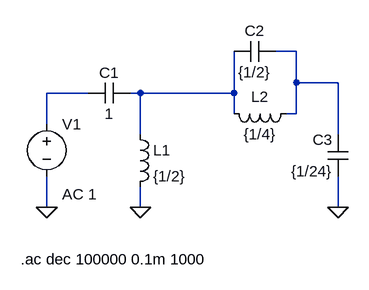
[diagram p0: schematic 2_bonus.asc]
2_bonus.asc, the LTspice schematic file:
Version 4.1
SHEET 1 880 680
WIRE 400 64 368 64
WIRE 400 112 400 64
WIRE 464 112 400 112
WIRE 80 128 16 128
WIRE 160 128 144 128
WIRE 304 128 304 64
WIRE 304 128 160 128
WIRE 304 160 304 128
WIRE 400 160 400 112
WIRE 400 160 384 160
WIRE 16 176 16 128
WIRE 160 192 160 128
WIRE 464 192 464 112
WIRE 16 304 16 256
WIRE 160 304 160 272
WIRE 464 304 464 256
FLAG 464 304 0
FLAG 160 304 0
FLAG 16 304 0
SYMBOL cap 80 144 R270
WINDOW 0 32 32 VTop 2
WINDOW 3 0 32 VBottom 2
SYMATTR InstName C1
SYMATTR Value 1
SYMBOL cap 368 48 R90
WINDOW 0 0 32 VBottom 2
WINDOW 3 32 32 VTop 2
SYMATTR InstName C2
SYMATTR Value {1/2}
SYMBOL cap 480 256 R180
WINDOW 0 24 56 Left 2
WINDOW 3 24 8 Left 2
SYMATTR InstName C3
SYMATTR Value {1/24}
SYMBOL ind 144 176 R0
SYMATTR InstName L1
SYMATTR Value {1/2}
SYMBOL ind 400 144 R90
WINDOW 0 5 56 VBottom 2
WINDOW 3 32 56 VTop 2
SYMATTR InstName L2
SYMATTR Value {1/4}
SYMBOL voltage 16 160 R0
WINDOW 123 24 124 Left 2
WINDOW 39 0 0 Left 0
SYMATTR InstName V1
SYMATTR Value ""
SYMATTR Value2 AC 1
TEXT -24 384 Left 2 !.ac dec 100000 0.1m 1000

The netlist it stands for:
* 2_bonus.asc
C1 N002 N003 1
C2 N001 N003 {1/2}
C3 0 N001 {1/24}
L1 N003 0 {1/2}
L2 N001 N003 {1/4}
V1 N002 0 AC 1
.ac dec 100000 0.1m 1000
.backanno
.end